# EAGLE design WiFi Block Controller v2 (EAGLE 7.7.0)
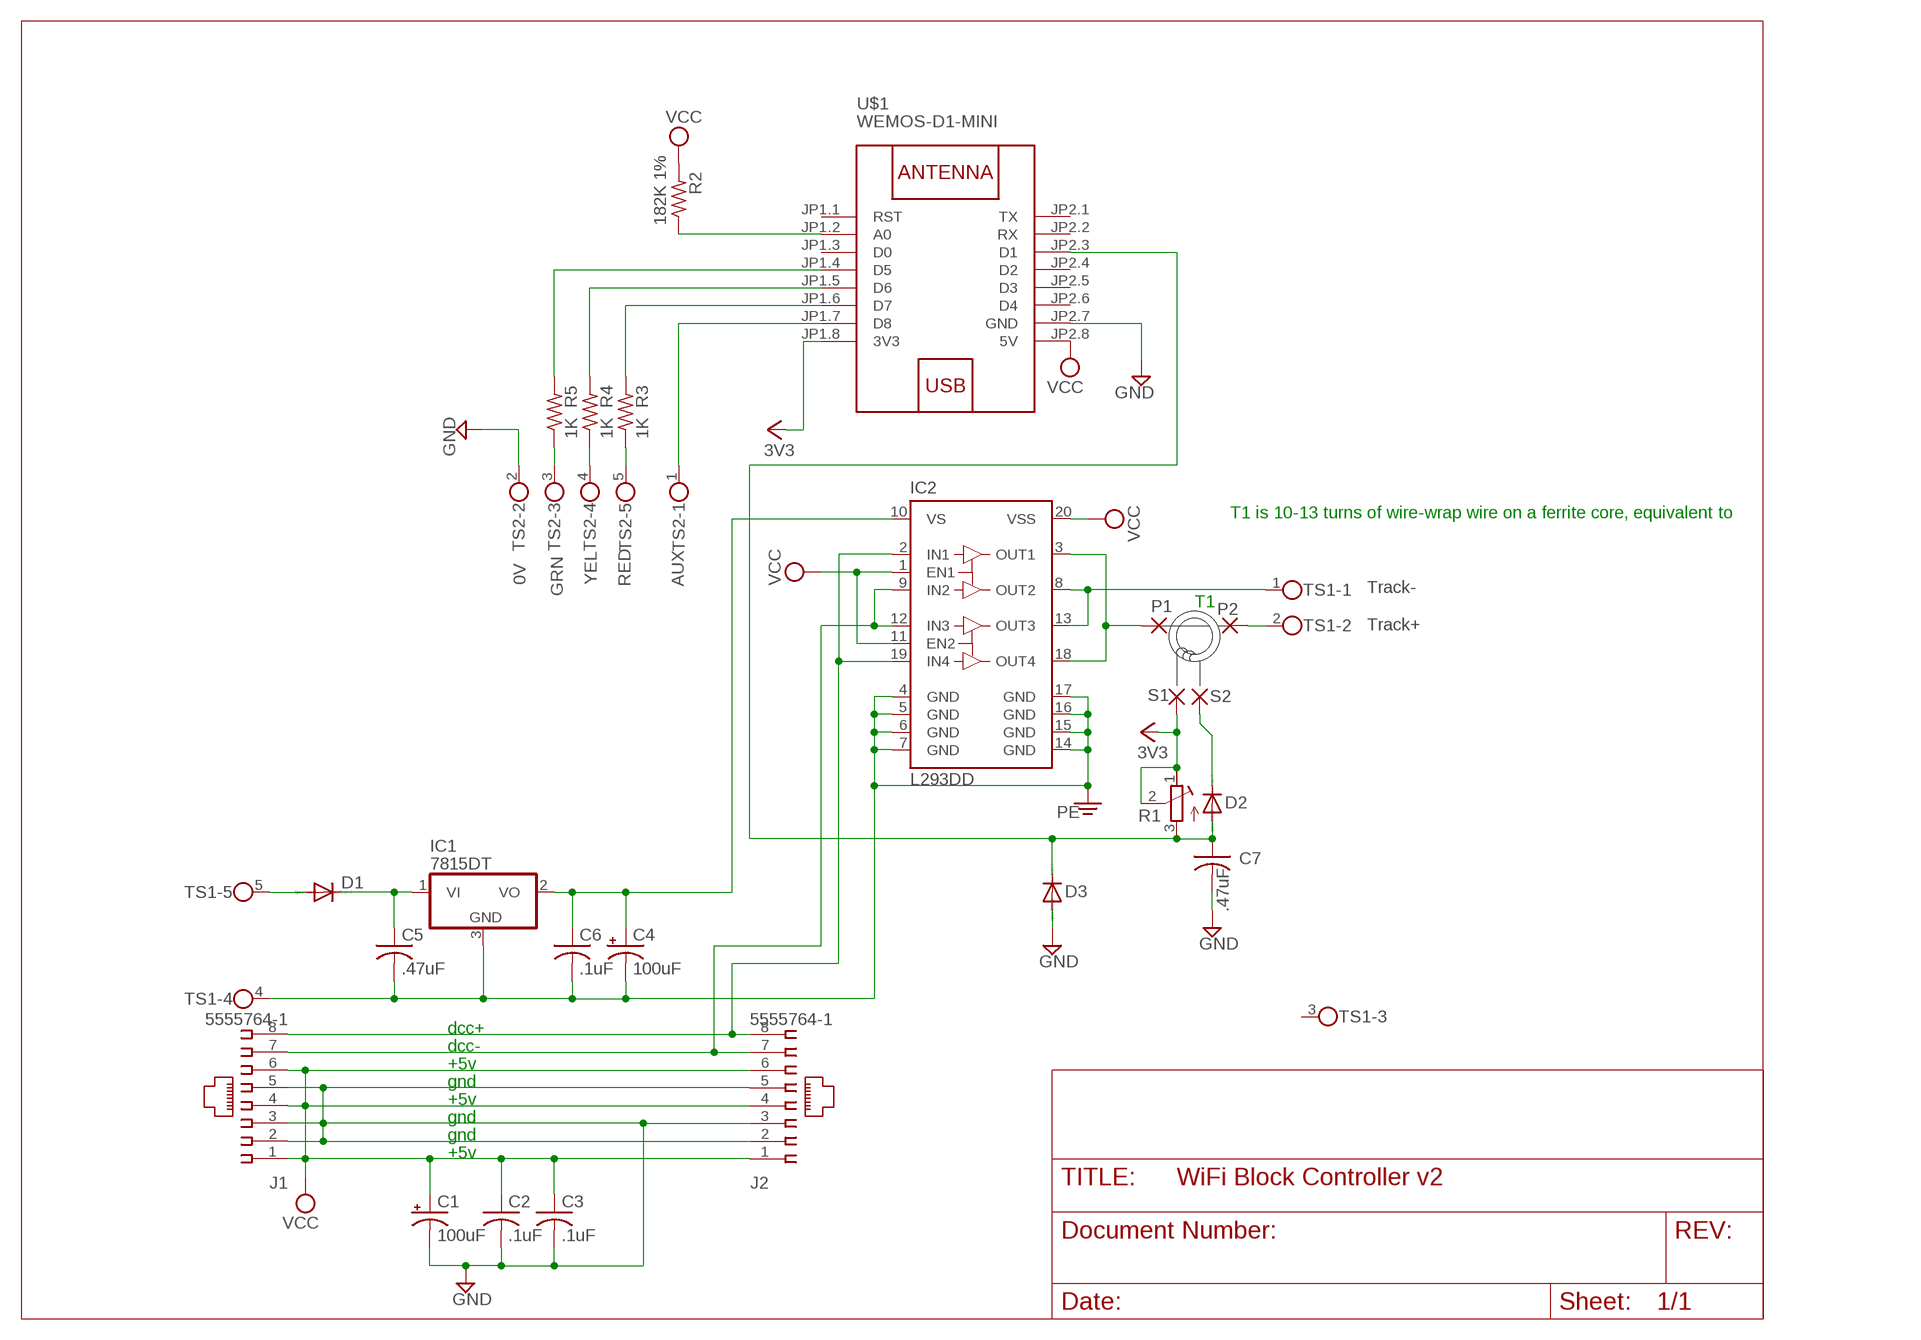
[diagram p0: schematic, sheet 1]

## Parts
C1  100uF  CPOL-USE3.5-8  [E3,5-8]
C2  .1uF  C-USC1206  [C1206]
C3  .1uF  C-USC1206  [C1206]
C4  100uF  CPOL-USE3.5-8  [E3,5-8]
C5  .47uF  C-USC1206  [C1206]
C6  .1uF  C-USC1206  [C1206]
C7  .47uF  C-USC1206  [C1206]
D1  DIODE-DO-214AC  [DO-214AC]
D2  DIODE-SOD123  [SOD123]
D3  DIODE-SOD123  [SOD123]
IC1  7815DT  7818DT  [TO252]
IC2  L293DD  [SO20]
J1  5555764-1  520426-4  [520426-4]
J2  5555764-1  520426-4  [520426-4]
P1  NA  2,15/1,0  [2,15/1,0]
P2  NA  2,15/1,0  [2,15/1,0]
R1  R-TRIMM3314G  [RTRIM3314G]
R2  182K 1%  R-US_M1206  [M1206]
R3  1K  R-US_M1206  [M1206]
R4  1K  R-US_M1206  [M1206]
R5  1K  R-US_M1206  [M1206]
S1  2,15/1,0  [2,15/1,0]
S2  2,15/1,0  [2,15/1,0]
TS1  TERMBLK05  [05PB]
TS2  TERMBLK05  [05PB]
U$1  WEMOS-D1-MINI  [WEMOS-D1-MINI]

## Nets
3V3: R1.1(E) R1.2(S) S1.1(P) U$1.JP1.8(3V3)
GND: C1.- C2.2 C3.2 C7.2 D3.A J1.2 J1.3 J1.5 J2.2 J2.3 J2.5 TS2.2 U$1.JP2.7(GND)
N$1: R5.1 TS2.3
N$2: R3.1 TS2.5
N$3: C7.1 D2.A D3.C R1.3(A) U$1.JP2.3(D1)
N$4: D1.A TS1.5
N$5: C5.1 D1.C IC1.1(VI)
N$7: IC2.9(IN2) IC2.12(IN3) J1.7 J2.7
N$11: R4.1 TS2.4
N$12: R2.1 U$1.JP1.2(A0)
N$15: R5.2 U$1.JP1.4(D5)
N$16: R4.2 U$1.JP1.5(D6)
N$17: R3.2 U$1.JP1.6(D7)
N$18: IC2.2(IN1) IC2.19(IN4) J1.8 J2.8
N$19: TS2.1 U$1.JP1.7(D8)
N$20: P2.1(P) TS1.2
N$21: IC2.3(OUT1) IC2.18(OUT4) P1.1(P)
N$34: IC2.8(OUT2) IC2.13(OUT3) TS1.1
N$45: D2.C S2.1(P)
PE: C4.- C5.2 C6.2 IC1.3(GND) IC2.4(GND) IC2.5(GND) IC2.6(GND) IC2.7(GND) IC2.14(GND) IC2.15(GND) IC2.16(GND) IC2.17(GND) TS1.4
VCC: C1.+ C2.1 C3.1 IC2.1(EN1) IC2.11(EN2) IC2.20(VSS) J1.1 J1.4 J1.6 J2.1 J2.4 J2.6 R2.2 U$1.JP2.8(5V)
VS: C4.+ C6.1 IC1.2(VO) IC2.10(VS)
Unconnected: TS1.3 U$1.JP1.1(RST) U$1.JP1.3(D0) U$1.JP2.1(TX) U$1.JP2.2(RX) U$1.JP2.4(D2) U$1.JP2.5(D3) U$1.JP2.6(D4)

## Notes on the sheet
- T1 is 10-13 turns of wire-wrap wire on a ferrite core, equivalent to
- GRN
- 0V | YEL | RED | AUX
- Track-
- T1
- Track+
- dcc+
- dcc-
- +5v
- gnd
- +5v
- gnd
- gnd
- +5v

## Library data of the parts
C1 C4 = rcl:CPOL-US: POLARIZED CAPACITOR, American symbol
C2 C3 C5-C7 = rcl:C-US: CAPACITOR, American symbol
D1-D3 = diode:DIODE-: DIODE
IC1 = linear:78*: Positive VOLTAGE REGULATOR Source: http://cache.national.com/ds/LM/LM78L05.pdf http://www.fairchildsemi.com/ds/LM/LM7805.pdf
IC2 = st-microelectronics:L293DD: PUSH-PULL FOUR CHANNEL DRIVER WITH DIODES Source: http://www.st.com/stonline/books/pdf/docs/1330.pdf; OC_FARNELL: unknown
J1 J2 = con-amp:520426-4: AMP connector
P1 P2 S1 S2 = wirepad:2,15/1,0: THROUGH-HOLE PAD
R1 = rcl:R-TRIMM: Trimm resistor
R2-R5 = rcl:R-US_: RESISTOR, American symbol
TS1 TS2 = cdb:TERMBLK05
U$1 = diy-modules:WEMOS-D1-MINI: WEMOS D1 mini: Mini Wi-Fi Board based on ESP-8266 device More details can be found here: https://www.wemos.cc/product/d1-mini.html Click here to find device on ebay.com <http://www.ebay.com/sch/wemos+d1+mini+nodemcu>

## Board
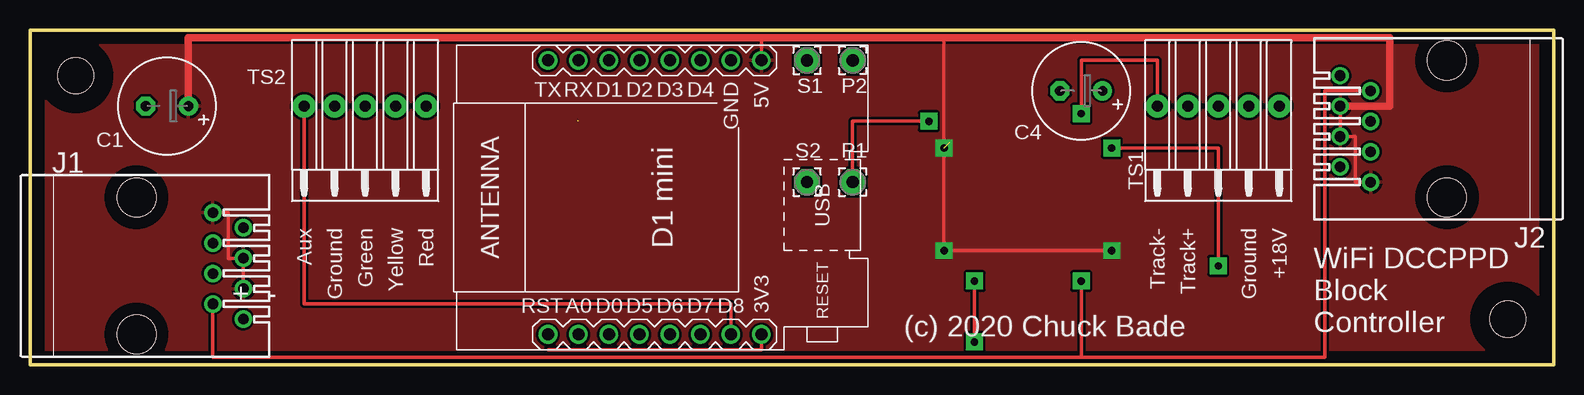
[diagram p1: board, top side]
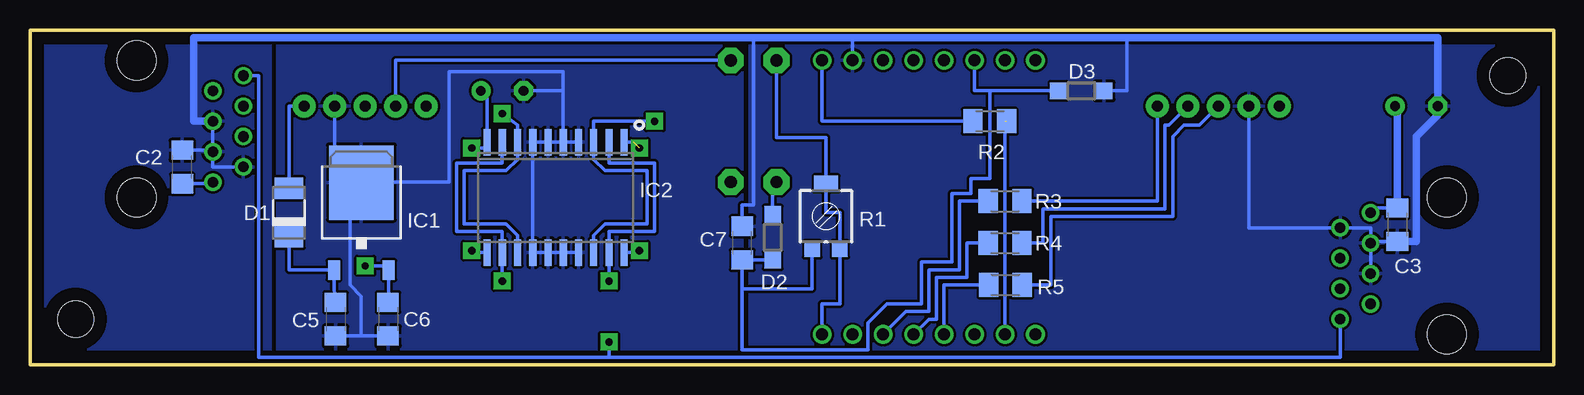
[diagram p2: board, bottom side, seen from below]

Size 127 x 27.94 mm. Coordinates in mm from the lower left corner, seen from the top.
Outline: 0,0 127,0 127,27.94 0,27.94 0,0
Copper layers (1*16): Top 0.035mm / dielectric 1.5mm / Bottom 0.035mm
Design rules "default *": minimum track width 10mil, minimum drill 10mil, track to track 8mil, track to pad 8mil, pad to pad 8mil, via to via 8mil, smd to smd 8mil, copper to edge 40mil, drill to drill 8mil, minimum pad ring 11mil, minimum via ring 16mil, stop-mask expansion 4mil, vias tented up to drill 0mil, thermal gap 10mil

### Footprints (pad centres in the part's own frame; a part is rotated, then mirrored left to right if it is on the bottom)
E3,5-8 = drill 0.813 pad 1.6: + -1.778,0 | drill 0.813 pad 1.6 octagon: - 1.778,0
C1206 = smd 1.6 x 1.8: 1 -1.4,0; 2 1.4,0
DO-214AC = smd 1.8 x 2.4: A 2.025,0; C -2.025,0
SOD123 = smd 1.4 x 1.4: A 1.9,0; C -1.9,0
TO252 = smd 1 x 1.6: 1 -2.28,-4.8; 2 2.28,-4.8 | smd 5.4 x 6.2: 3 0,2.5
SO20 = smd 0.6 x 2.2: 1 -5.715,-4.6; 2 -4.445,-4.6; 3 -3.175,-4.6; 4 -1.905,-4.6; 5 -0.635,-4.6; 6 0.635,-4.6; 7 1.905,-4.6; 8 3.175,-4.6; 9 4.445,-4.6; 10 5.715,-4.6; 11 5.715,4.6; 12 4.445,4.6; 13 3.175,4.6; 14 1.905,4.6; 15 0.635,4.6; 16 -0.635,4.6; 17 -1.905,4.6; 18 -3.175,4.6; 19 -4.445,4.6; 20 -5.715,4.6
520426-4 = drill 0.889: 1 -4.445,6.35; 2 -3.175,8.89; 3 -1.905,6.35; 4 -0.635,8.89; 5 0.635,6.35; 6 1.905,8.89; 7 3.175,6.35; 8 4.445,8.89 | hole 3.251: -5.715,0; 5.715,0
2,15/1,0 = drill 1.016 pad 2.159 octagon: 1 0,0
RTRIM3314G = smd 1.3 x 1.3: 1 1.15,-2.75; 3 -1.15,-2.75 | smd 2 x 1.3: 2 0,2.75
M1206 = smd 1.6 x 2: 1 -1.4,0; 2 1.4,0
05PB = drill 0.914 pad 1.93: 1 5.08,-1.27; 2 2.54,-1.27; 3 0,-1.27; 4 -2.54,-1.27; 5 -5.08,-1.27
WEMOS-D1-MINI = drill 1: JP1.1 -11.43,9.525; JP1.2 -11.43,6.985; JP1.3 -11.43,4.445; JP1.4 -11.43,1.905; JP1.5 -11.43,-0.635; JP1.6 -11.43,-3.175; JP1.7 -11.43,-5.715; JP1.8 -11.43,-8.255; JP2.1 11.43,9.525; JP2.2 11.43,6.985; JP2.3 11.43,4.445; JP2.4 11.43,1.905; JP2.5 11.43,-0.635; JP2.6 11.43,-3.175; JP2.7 11.43,-5.715; JP2.8 11.43,-8.255
4-40SCREW = hole 2.997: 0,0

### Placement (x,y rotation side)
C1  11.43,21.59 180 top
C2  114.3,16.51 90 bottom
C3  13.02,11.68 270 bottom
C4  87.63,22.86 180 top
C5  101.54,3.81 270 bottom
C6  97.16,3.81 270 bottom
C7  67.63,10.16 90 bottom
D1  105.41,12.7 90 bottom
D2  65.09,10.64 270 bottom
D3  39.37,22.86 0 bottom
IC1  99.38,12.7 0 bottom
IC2  83.19,13.97 180 bottom
J1  8.89,8.26 270 top
J2  118.11,19.68 90 top
P1  68.58,15.24 0 top
P2  68.58,25.4 0 top
R1  60.64,12.38 0 bottom
R2  46.99,20.32 180 bottom
R3  45.72,13.65 180 bottom
R4  45.72,10.16 180 bottom
R5  45.69,6.67 180 bottom
S1  64.77,25.4 0 top
S2  64.77,15.24 0 top
TS1  99.06,20.32 180 top
TS2  27.94,20.32 180 top
U$1  52.7,13.97 90 top
U$3  [4-40SCREW]  3.81,24.13 0 top
U$4  [4-40SCREW]  123.19,3.81 0 top

### Tracks (layer width: path | path; a pad name or v marks a point on that pad's centre or on a via)
3V3
  Top 0.305: 43.18,1.27 60.96,1.27 U$1.JP1.8
  Bottom 0.305: S1.1 64.77,18.94 60.64,18.94 R1.2 60.64,12.7 59.49,12.7 R1.1 59.49,5.08 60.96,5.08 U$1.JP1.8
GND
  Bottom 0.305: J1.5 J1.3 | C2.2 111.89,17.91 J2.3 | J2.2 111.76,16.51 J2.3 | TS2.2 25.4,11.43 J1.2 15.24,11.43 J1.3 | U$1.JP2.7 58.42,27.3 | J2.5 J2.3 | C7.2 67.63,13.34 66.67,13.34 66.67,27.3 | D3.A 35.56,22.86 35.56,27.3 | J1.3 15.12,10.28 C3.2
  Bottom 0.61: J2.5 113.35,20.32 113.35,27.3 66.67,27.3 58.42,27.3 35.56,27.3 9.65,27.3 C1.- 9.65,20.83 11.43,19.05 11.43,10.28 C3.2
  pour Bottom: -0.95,28.57 66.99,28.57 66.99,-0.95 -0.95,-0.95
  pour Bottom: 127.95,28.57 107,28.57 107,-0.95 127.95,-0.95
N$1
  Bottom 0.305: R5.1 41.91,6.67 41.91,12.38 31.75,12.38 31.75,19.05 30.8,20 29.53,20 TS2.3
N$2
  Bottom 0.305: R3.1 33.02,13.65 TS2.5
N$3
  Bottom 0.305: D2.A C7.1 67.63,6.35 | R1.3 61.79,6.35 67.63,6.35 | U$1.JP2.3 48.26,22.86 46.99,22.86 | D3.C 46.99,22.86 | 46.99,22.86 46.99,15.56 48.58,15.56 48.58,14.29 50.16,14.29 50.16,8.57 52.7,8.57 52.7,5.08 55.56,5.08 57.15,3.49 57.15,1.27 67.63,1.27 67.63,6.35
N$4
  Bottom 0.305: TS1.5 105.41,21.59 D1.A
N$5
  Bottom 0.305: 101.73,7.9 IC1.1 | IC1.1 101.66,6.28 C5.1 101.54,5.08 | D1.C 105.41,7.9 IC1.1
N$7  (via drill 0.6)
  Top 0.305: J1.7 15.24,0.64 87.63,0.64 | 87.63,0.64 107.95,0.64 107.95,22.86 J2.7 | v87.63,6.99 87.63,0.64
  Bottom 0.305: IC2.9 87.63,16.83 91.44,16.83 91.44,11.11 87.63,11.11 IC2.12 v87.63,6.99
N$11
  Bottom 0.305: R4.1 42.55,10.16 42.55,13.02 32.38,13.02 32.38,20 32.07,20 TS2.4
N$12  (1 unrouted)
  Bottom 0.305: 45.72,20.32 U$1.JP1.2
N$15
  Bottom 0.305: R5.2 50.8,6.67 U$1.JP1.4
N$16
  Bottom 0.305: R4.2 48.9,10.16 48.9,7.3 51.44,7.3 51.44,3.81 52.07,3.81 U$1.JP1.5
N$17
  Bottom 0.305: R3.2 49.53,13.65 49.53,7.94 52.07,7.94 52.07,4.45 53.98,4.45 U$1.JP1.6
N$18  (via drill 0.6)
  Top 0.305: v78.74,6.99 v78.74,1.91
  Bottom 0.305: IC2.2 78.74,16.83 74.93,16.83 74.93,11.11 78.74,11.11 IC2.19 v78.74,6.99 | J1.8 17.78,0.64 78.74,0.64 | 78.74,0.64 107.95,0.64 107.95,24.13 J2.8 | v78.74,1.91 78.74,0.64
N$19
  Top 0.305: TS2.1 22.86,5.08 58.42,5.08 U$1.JP1.7
N$20
  Bottom 0.305: P2.1 96.52,25.4 TS1.2
N$21  (via drill 0.6)
  Top 0.305: v74.93,20.32 68.58,20.32 P1.1
  Bottom 0.305: IC2.18 80.01,10.79 79.06,11.75 75.56,11.75 75.56,16.19 79.06,16.19 80.01,17.14 IC2.3 80.01,20.32 v74.93,20.32
N$34  (via drill 0.6)
  Top 0.305: v87.63,20.95 87.63,25.4 93.98,25.4 TS1.1
  Bottom 0.305: IC2.13 86.36,10.79 87.31,11.75 90.81,11.75 90.81,16.19 87.31,16.19 86.36,17.14 IC2.8 86.36,20 v87.63,20.95
N$45
  Bottom 0.305: D2.C 65.09,14.92 S2.1
PE
  Bottom 0.305: IC2.5 IC2.6 IC2.7 IC2.14 IC2.15 IC2.16 IC2.17 | IC2.4 IC2.5 | C6.2 99.38,2.41 | 99.38,2.41 C5.2 | 82.55,22.86 82.55,24.45 92.08,24.45 92.08,15.24 99.38,15.24 IC1.3 100.33,15.2 | 82.55,22.86 IC2.5 | 100.33,15.2 100.33,15.24 101.6,15.24 TS1.4 | C4.- 82.55,22.86 | 100.33,15.2 100.33,6.67 99.38,5.71 99.38,2.41
  pour Bottom: 67.63,28.57 106.36,28.57 106.36,-0.95 67.63,-0.95
VCC  (via drill 0.6)  (1 unrouted)
  Top 0.305: J1.6 J1.4 16.51,8.89 16.51,12.7 J1.1 | J2.6 J2.4 110.49,19.05 110.49,15.24 J2.1 | U$1.JP2.8 60.96,27.3 | v90.17,9.53 v76.2,9.53 v76.2,18.1 76.2,27.3
  Top 0.61: J2.6 113.35,21.59 113.35,27.3 76.2,27.3 60.96,27.3 13.21,27.3 C1.+
  Bottom 0.305: 88.9,9.84 IC2.11 90.02,9.37 v90.17,9.53 | 77.47,18.73 IC2.1 76.67,18.57 | C2.1 111.89,15.11 J2.1 | R2.2 60.96,20.32 U$1.JP2.8 | IC2.20 76.36,9.37 v76.2,9.53 | J1.1 14.86,13.08 C3.1
  Bottom 0.61: C1.+ 13.02,21.4 C3.1
  pour Top: -2.22,29.53 129.22,29.21 129.22,-1.59 -2.22,-1.27
VS  (via drill 0.6)
  Top 0.305: v90.17,18.1 99.06,18.1 v99.06,8.26
  Bottom 0.305: IC1.2 97.1,7.62 | C6.1 97.1,6.22 IC1.2 | v90.17,18.1 88.9,18.1 IC2.10 88.9,22.86 C4.+ | 97.79,5.71 C6.1 | 97.16,5.08 C6.1 | v99.06,8.26 97.1,8.26 IC1.2

### Text on the board
tNames: Aux | Ground | Green | Yellow | Red | Track- | Track+ | Ground | +18V | + - | (c) 2020 Chuck Bade | WiFi DCCPPD / Block / Controller